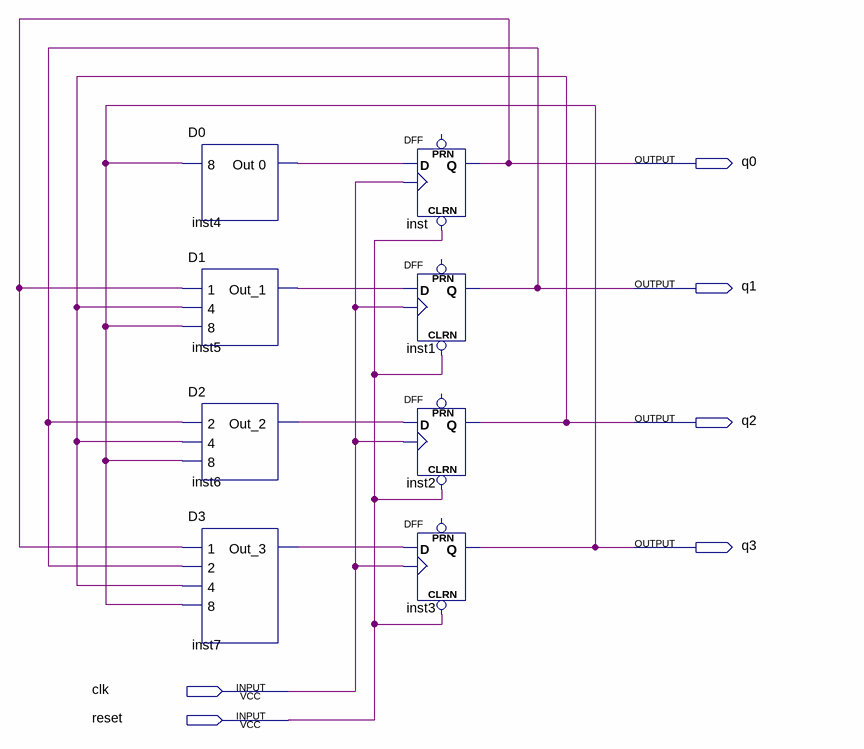
[diagram p0: schematic sheet]
// Quartus schematic BCD counter.bdf as structural Verilog: 8 symbols, 6 pins
module \BCD_counter  (
  input  clk,
  input  reset,
  output q0,
  output q1,
  output q2,
  output q3
);

  wire inst4_out_0, inst5_out_1, inst6_out_2, inst7_out_3;

  D0 inst4 (.\8 (q3), .\Out_0 (inst4_out_0));
  D1 inst5 (.\1 (q0), .\4 (q2), .\8 (q3), .Out_1(inst5_out_1));
  D2 inst6 (.\2 (q1), .\4 (q2), .\8 (q3), .Out_2(inst6_out_2));
  D3 inst7 (.\1 (q0), .\2 (q1), .\4 (q2), .\8 (q3), .Out_3(inst7_out_3));
  DFF inst (.CLRN(reset), .CLK(clk), .D(inst4_out_0), .Q(q0));  // open: PRN
  DFF inst1 (.CLRN(reset), .CLK(clk), .D(inst5_out_1), .Q(q1));  // open: PRN
  DFF inst2 (.CLRN(reset), .CLK(clk), .D(inst6_out_2), .Q(q2));  // open: PRN
  DFF inst3 (.CLRN(reset), .CLK(clk), .D(inst7_out_3), .Q(q3));  // open: PRN
endmodule
